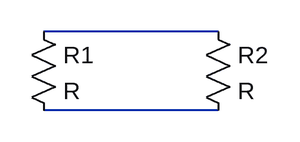
[diagram p0: schematic Test.asc]
Test.asc, the LTspice schematic file:
Version 4
SHEET 1 880 680
WIRE 304 112 128 112
WIRE 304 192 128 192
SYMBOL res 112 96 R0
SYMATTR InstName R1
SYMBOL res 288 96 R0
SYMATTR InstName R2

The netlist it stands for:
* Test.asc
R1 N001 N002 R
R2 N001 N002 R
.backanno
.end